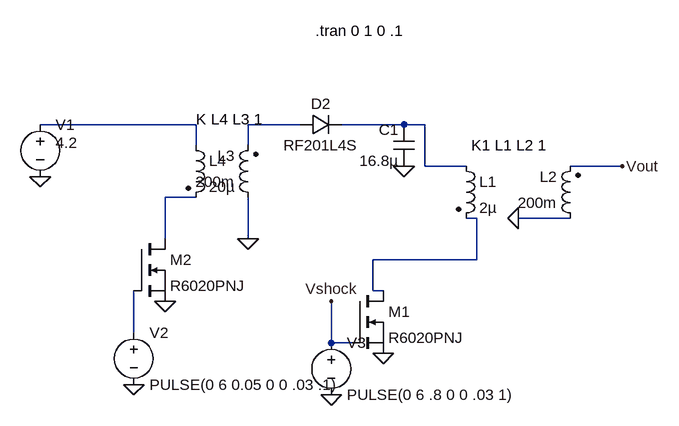
[diagram p0: schematic ShockCircuit.asc]
ShockCircuit.asc, the LTspice schematic file:
Version 4
SHEET 1 880 680
WIRE -256 -720 -496 -720
WIRE -96 -720 -176 -720
WIRE 64 -720 -32 -720
WIRE 96 -720 64 -720
WIRE -256 -688 -256 -720
WIRE -176 -688 -176 -720
WIRE 96 -656 96 -720
WIRE 160 -656 96 -656
WIRE 400 -656 320 -656
WIRE -256 -608 -304 -608
WIRE 176 -576 160 -576
WIRE 320 -576 240 -576
WIRE -304 -544 -304 -608
WIRE -176 -544 -176 -608
WIRE 176 -512 176 -576
WIRE 176 -512 16 -512
WIRE 16 -464 16 -512
WIRE 32 -464 16 -464
WIRE -352 -400 -352 -464
WIRE -48 -384 -48 -448
WIRE -16 -384 -48 -384
FLAG 400 -656 Vout
FLAG -176 -544 0
FLAG 32 -368 0
FLAG -304 -448 0
FLAG 240 -576 0
FLAG -352 -320 0
FLAG -48 -304 0
FLAG -48 -448 Vshock
FLAG -496 -640 0
FLAG 64 -656 0
SYMBOL diode -96 -704 R270
WINDOW 0 32 32 VTop 2
WINDOW 3 0 32 VBottom 2
SYMATTR InstName D2
SYMATTR Value RF201L4S
SYMBOL cap 80 -656 R180
WINDOW 0 24 56 Left 2
WINDOW 3 24 8 Left 2
SYMATTR InstName C1
SYMATTR Value 16.8µ
SYMBOL ind2 144 -672 R0
SYMATTR InstName L1
SYMATTR Value 2µ
SYMATTR Type ind
SYMBOL ind2 336 -560 R180
WINDOW 0 36 80 Left 2
WINDOW 3 36 40 Left 2
SYMATTR InstName L2
SYMATTR Value 200m
SYMATTR Type ind
SYMBOL ind2 -160 -592 R180
WINDOW 0 36 80 Left 2
WINDOW 3 36 40 Left 2
SYMATTR InstName L3
SYMATTR Value 200m
SYMATTR Type ind
SYMBOL ind2 -272 -704 R0
SYMATTR InstName L4
SYMATTR Value 20µ
SYMATTR Type ind
SYMBOL nmos -16 -464 R0
SYMATTR InstName M1
SYMATTR Value R6020PNJ
SYMBOL nmos -352 -544 R0
SYMATTR InstName M2
SYMATTR Value R6020PNJ
SYMBOL voltage -352 -416 R0
WINDOW 123 0 0 Left 0
WINDOW 39 0 0 Left 0
SYMATTR InstName V2
SYMATTR Value PULSE(0 6 0.05 0 0 .03 .1)
SYMBOL voltage -48 -400 R0
WINDOW 123 0 0 Left 0
WINDOW 39 0 0 Left 0
SYMATTR InstName V3
SYMATTR Value PULSE(0 6 .8 0 0 .03 1)
SYMBOL voltage -496 -736 R0
WINDOW 123 0 0 Left 0
WINDOW 39 0 0 Left 0
WINDOW 3 24 44 Left 2
SYMATTR InstName V1
SYMATTR Value 4.2
TEXT 168 -688 Left 2 !K1 L1 L2 1
TEXT -256 -728 Left 2 !K L4 L3 1
TEXT -72 -864 Left 2 !.tran 0 1 0 .1

The netlist it stands for:
* ShockCircuit.asc
D2 N002 N003 RF201L4S
C1 0 N003 16.8µ
L1 N003 N005 2µ
L2 0 Vout 200m
L3 0 N002 200m
L4 N001 N004 20µ
M1 N005 Vshock 0 0 R6020PNJ
M2 N004 N006 0 0 R6020PNJ
V2 N006 0 PULSE(0 6 0.05 0 0 .03 .1)
V3 Vshock 0 PULSE(0 6 .8 0 0 .03 1)
V1 N001 0 4.2
.model D D
.lib standard.dio
.model NMOS NMOS
.model PMOS PMOS
.lib standard.mos
K1 L1 L2 1
K L4 L3 1
.tran 0 1 0 .1
.backanno
.end